# Altium schematic sheet MicroCurrent.SchDoc: ="Title"
size A4; Author: ARNik; SheetNumber: 1; SheetTotal: 1
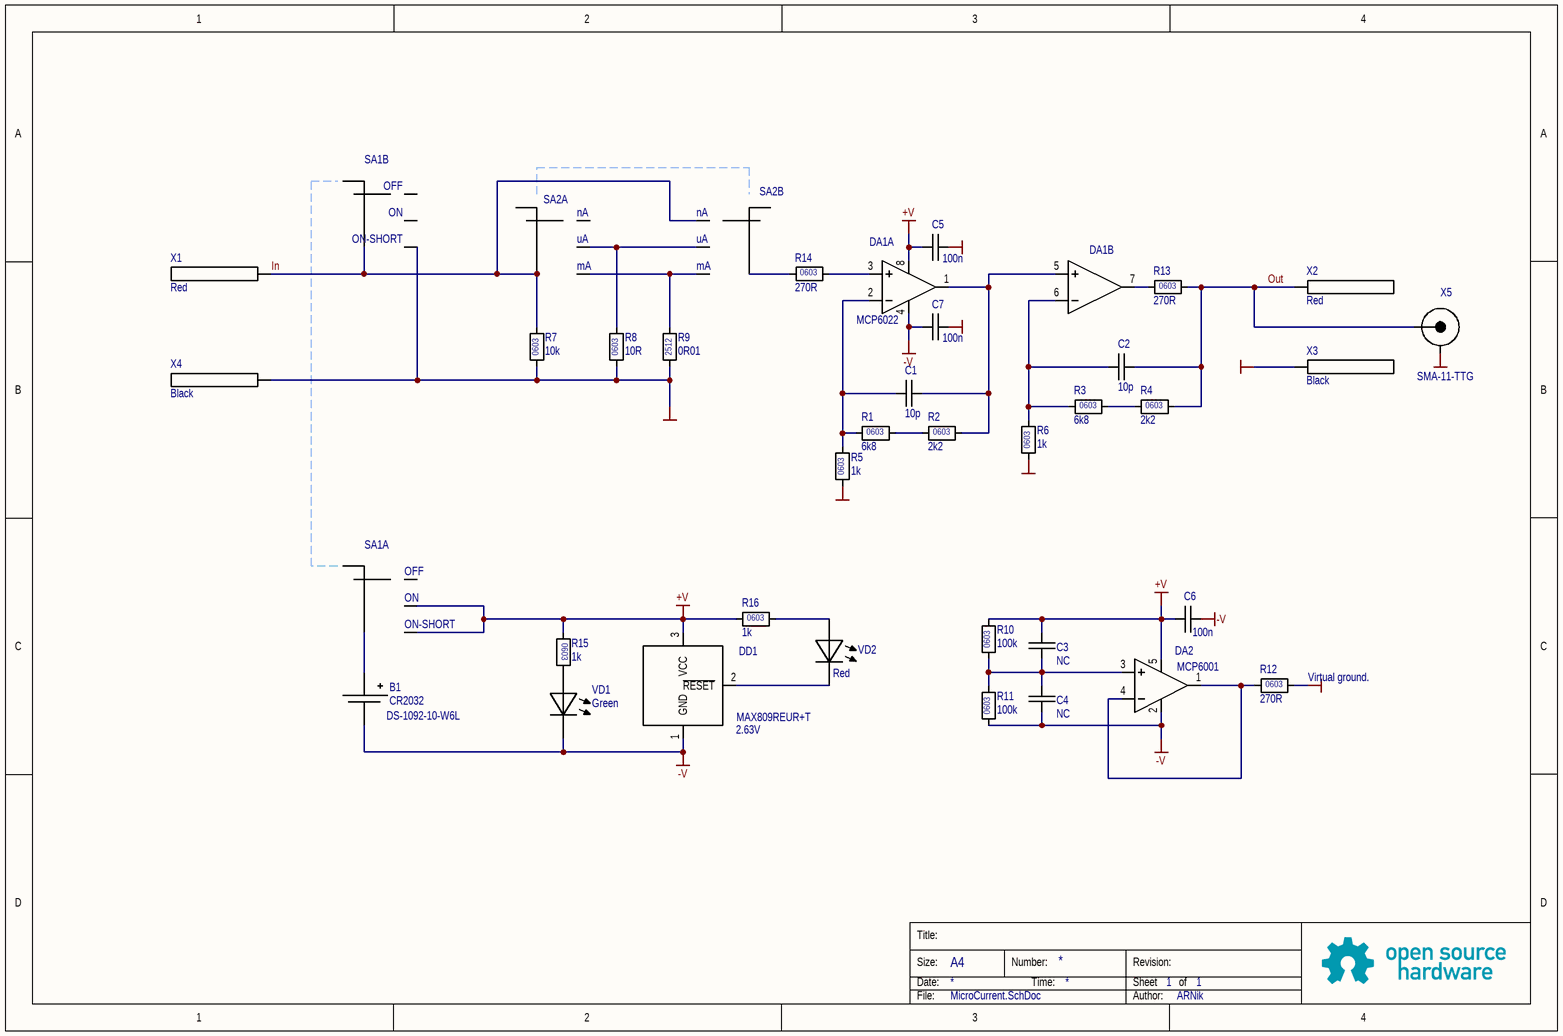
[diagram p0: MicroCurrent.SchDoc]

## Parts
B1  CR2032  Part Number: DS-1092-10-W6L  [DS1092-10-W6L]
C1  10p  [C0603]
C2  10p  [C0603]
C3  NC  [C0603]  (no BOM)
C4  NC  [C0603]  (no BOM)
C5  100n  [C0603]
C6  100n  [C0603]
C7  100n  [C0603]
DA1  MCP6022  [Microchip-SOIC8 SN]  (parts A,B of 2)
DA2  MCP6001  [MICROCHIP-SOT-23-5 OT]
DD1  2.63V  Part Number: MAX809REUR+T  [MAXIM-SOT23-3L]
R1  6k8  [R0603]
R2  2k2  [R0603]
R3  6k8  [R0603]
R4  2k2  [R0603]
R5  1k  [R0603]
R6  1k  [R0603]
R7  10k  [R0603]
R8  10R  [R0603]
R9  0R01  [R2512]
R10  100k  [R0603]
R11  100k  [R0603]
R12  270R  [R0603]
R13  270R  [R0603]
R14  270R  [R0603]
R15  1k  [R0603]
R16  1k  [R0603]
SA1  (no value)  (parts A,B of 2)
SA2  (no value)  (parts A,B of 2)
VD1  Green  [LTST-C191 GREEN]
VD2  Red  [LTST-C193 RED]
X1  Red  [RTC5060185-red]
X2  Red  [RTC5060185-red]
X3  Black  [RTC5060185-black]
X4  Black  [RTC5060185-black]
X5  Connector HF  [SMA-11-TTG]  (value not drawn)  (no BOM)

## Nets
+V: C3.1 C5.1 C6.2 DA1.8(VCC) DA2.5(VCC) DD1.3(VCC) R10.2 R15.1 R16.1 SA1.3.1 SA1.4.1
-V: B1.2 C4.2 C6.1 C7.1 DA1.4(GND) DA2.2(GND) DD1.1(GND) R11.1 VD1.1(C)
GND: C5.2 C7.2 R5.1 R6.1 R7.1 R8.1 R9.1 R12.2 SA1.4.2 X3.1 X4.1 X5.2
In: R7.2 SA1.2.2 SA2.1.2 SA2.2.1 X1.1
Out: C2.2 R4.2 R13.2 X2.1 X5.1
NetB1_1: B1.1 SA1.2.1
NetC1_1: C1.1 DA1.2(1IN-) R1.1 R5.2
NetC1_2: C1.2 DA1.1(1OUT) DA1.5(2IN+) R2.2
NetC2_1: C2.1 DA1.6(2IN-) R3.1 R6.2
NetC3_2: C3.2 C4.1 DA2.3(1IN+) R10.1 R11.2
NetDA1_3: DA1.3(1IN+) R14.2
NetDA1_7: DA1.7(2OUT) R13.1
NetDA2_1: DA2.1(1OUT) DA2.4(1IN-) R12.1
NetDD1_2: DD1.2(~{RESET}) VD2.1(C)
NetR1_2: R1.2 R2.1
NetR3_2: R3.2 R4.1
NetR8_2: R8.2 SA2.3.1 SA2.3.2
NetR9_2: R9.2 SA2.4.1 SA2.4.2
NetR14_1: R14.1 SA2.2.2
NetR15_2: R15.2 VD1.2(A)
NetR16_2: R16.2 VD2.2(A)

Not connected (* = marked no-connect by the designer): SA1 1.1 1.2 3.2; SA2 1.1

## Notes on the sheet
- (near SA1) OFF
- (near SA1) ON
- (near SA1) ON-SHORT
- (near SA2) nA
- (near SA2) uA
- (near SA2) mA
- (near R12) Virtual ground.
- Title:
- Size:
- Date:
- A4
- Number:
- Time:
- Revision:
- Sheet
- of
- File:
- Author:
- (in symbol R0603 1k ±1% E24) 0603
- (in symbol R0603 2k2 ±1% E24) 0603
- (in symbol R0603 6k8 ±1% E24) 0603
- (in symbol R0603 10k ±1% E24) 0603
- (in symbol R0603 10R ±1% E24) 0603
- (in symbol R0603 100k ±1% E24) 0603
- (in symbol R0603 270R ±1% E24) 0603
- (in symbol R2512 1R ±1% E24) 2512

## Library data of the parts
B1 = DS-1092-10-W6L: CR2032 SMD battery holder; Vendor: Connfly; Component Name: DS-1092-10-W6L; HelpURL: https://static.chipdip.ru/lib/011/DOC004011758.pdf; Pins: 2; Value: CR2032
C1 C2 = C0603 10p 100V C0G 125°C ±0.5pF: Commercial Grade Mid Voltage (100 to 630V) ceramic capacitor; Part Number: C1608C0G2A100D080AA; Voltage: 100V; Dielectric: C0G; Tolerance: ±0.5pF; Vendor: TDK; Component Name: C0603 10p 100V C0G 125°C ±0.5pF; HelpURL: https://product.tdk.com/en/search/capacitor/ceramic/mlcc/info?part_no=C1608C0G2A100D080AA; Temperature: -55 to +125°C; Pins: 2; Package: C0603; Value: 10p
C3 C4 = NC 0603 Cap: NC 0603 Capasitor; Component Name: NC 0603 Cap; Pins: 2; Package: C0603; Price: 0; Value: NC
C5-C7 = C0603 100n 100V X7R 125°C ±20%: General  ceramic capacitor; Part Number: GRM188R72A104MA35#; Voltage: 100V; Dielectric: X7R; Tolerance: ±20%; Vendor: Murata; Component Name: C0603 100n 100V X7R 125°C ±20%; HelpURL: https://psearch.en.murata.com/capacitor/result/smd/?pid=GRM188R72A104MA35#; Temperature: 125°C; Pins: 2; Package: C0603; Value: 100n
DA1 = MCP6022xI SN: OpAmp Low offset Low Vcc; Vendor: Microchip; Component Name: MCP6022xI SN; Part Number: MCP6022x; HelpURL: https://static.chipdip.ru/lib/355/DOC004355419.pdf; Pins: 8; Package: SOIC8; Value: MCP6022
DA2 = MCP6001xI OT: Low-Power Op Amp; Vendor: Microchip; Component Name: MCP6001xI OT; Part Number: MCP6001xI OT; HelpURL: https://static.chipdip.ru/lib/174/DOC001174516.pdf; Pins: 5; Package: SOT-23-5; Value: MCP6001
DD1 = MAX809REUR: Microprocessor Reset Circuit; Vendor: Maxim; Component Name: MAX809REUR; HelpURL: https://static.chipdip.ru/lib/235/DOC000235341.pdf; Pins: 3; Package: SOT-23; Value: 2.63V
R1 R3 = R0603 6k8 ±1% E24: Thick Film Chip Resistor - CR Series; Part Number: CR-03FL7---6k8; Alt Part: RTT036801FTH (Ralec); Vendor: Viking; Tolerance: ±1%; Voltage: 75V; Power: 1/10W; Component Name: R0603 6k8 ±1% E24; HelpURL: https://www.viking.com.tw/en/search/index.html?f%5Bname_model%5D=CR-03FL7---6k8&type=product; Pins: 2; Package: R0603; Price: 0.001; Value: 6k8
R2 R4 = R0603 2k2 ±1% E24: Thick Film Chip Resistor - CR Series; Part Number: CR-03FL7---2k2; Alt Part: RTT032201FTH (Ralec); Vendor: Viking; Tolerance: ±1%; Voltage: 75V; Power: 1/10W; Component Name: R0603 2k2 ±1% E24; HelpURL: https://www.viking.com.tw/en/search/index.html?f%5Bname_model%5D=CR-03FL7---2k2&type=product; Pins: 2; Package: R0603; Price: 0.001; Value: 2k2
R5 R6 R15 R16 = R0603 1k ±1% E24: Thick Film Chip Resistor - CR Series; Part Number: CR-03FL7----1k; Alt Part: RTT031001FTH (Ralec); Vendor: Viking; Tolerance: ±1%; Voltage: 75V; Power: 1/10W; Component Name: R0603 1k ±1% E24; HelpURL: https://www.viking.com.tw/en/search/index.html?f%5Bname_model%5D=CR-03FL7----1k&type=product; Pins: 2; Package: R0603; Price: 0.001; Value: 1k
R7 = R0603 10k ±1% E24: Thick Film Chip Resistor - CR Series; Part Number: CR-03FL7---10k; Alt Part: RTT031002FTH (Ralec); Vendor: Viking; Tolerance: ±1%; Voltage: 75V; Power: 1/10W; Component Name: R0603 10k ±1% E24; HelpURL: https://www.viking.com.tw/en/search/index.html?f%5Bname_model%5D=CR-03FL7---10k&type=product; Pins: 2; Package: R0603; Price: 0.001; Value: 10k
R8 = R0603 10R ±1% E24: Thick Film Chip Resistor - CR Series; Part Number: CR-03FL7---10R; Alt Part: RTT03100FTH (Ralec); Vendor: Viking; Tolerance: ±1%; Voltage: 75V; Power: 1/10W; Component Name: R0603 10R ±1% E24; HelpURL: https://www.viking.com.tw/en/search/index.html?f%5Bname_model%5D=CR-03FL7---10R&type=product; Pins: 2; Package: R0603; Price: 0.001; Value: 10R
R9 = R2512 1R ±1% E24: Thick Film Chip Resistor - CR Series; Part Number: CR-12FL4----1R; Alt Part: RTT251R0FTH (Ralec); Vendor: Viking; Tolerance: ±1%; Voltage: 250V; Power: 1W; Component Name: R2512 1R ±1% E24; HelpURL: https://www.viking.com.tw/en/search/index.html?f%5Bname_model%5D=CR-12FL4----1R&type=product; Pins: 2; Package: R2512; Price: 0.001; Value: 0R01
R10 R11 = R0603 100k ±1% E24: Thick Film Chip Resistor - CR Series; Part Number: CR-03FL7--100k; Alt Part: RTT031003FTH (Ralec); Vendor: Viking; Tolerance: ±1%; Voltage: 75V; Power: 1/10W; Component Name: R0603 100k ±1% E24; HelpURL: https://www.viking.com.tw/en/search/index.html?f%5Bname_model%5D=CR-03FL7--100k&type=product; Pins: 2; Package: R0603; Price: 0.001; Value: 100k
R12-R14 = R0603 270R ±1% E24: Thick Film Chip Resistor - CR Series; Part Number: CR-03FL7--270R; Alt Part: RTT032700FTH (Ralec); Vendor: Viking; Tolerance: ±1%; Voltage: 75V; Power: 1/10W; Component Name: R0603 270R ±1% E24; HelpURL: https://www.viking.com.tw/en/search/index.html?f%5Bname_model%5D=CR-03FL7--270R&type=product; Pins: 2; Package: R0603; Price: 0.001; Value: 270R
SA1 SA2 = SS23D07
VD1 = 0603 0h55 5mA GREEN KGKT: TopView Single Color Chip LED; Part Number: LTST-C191KGKT-5A; Vendor: Lite-On; WaveLength: 564.5-573.5 @5mA; Brightness: 4.5-18.0 @ 5mA; Current: 5mA; Component Name: 0603 0h55 5mA GREEN KGKT; HelpURL: http://optoelectronics.liteon.com/en-global/Led/LED-Component/Detail/448?param4=1; Pins: 2; Package: 0603 0h55; Value: Green
VD2 = 0603 0h35 5mA RED KRKT: TopView Single Color Chip LED; Part Number: LTST-C193KRKT-5A; Vendor: Lite-On; WaveLength: 631 @ 5mA; Brightness: 7.1~45 @ 5mA; Current: 5mA; Component Name: 0603 0h35 5mA RED KRKT; HelpURL: http://optoelectronics.liteon.com/en-global/Led/LED-Component/Detail/448?param4=1; Pins: 2; Package: 0603 0h35; Value: Red
X1 X2 = RTC5060185-red: Component Name: RTC5060185-red; Part Number: RTC5060185-red; Pins: 1; Value: Red
X3 X4 = RTC5060185-black: Component Name: RTC5060185-black; Part Number: RTC5060185-black; Pins: 1; Value: Black
X5 = SMA-11-TTG: angle sma connector; Vendor: Nus-Tsan; Component Name: SMA-11-TTG; Part Number: SMA-11-TTG; HelpURL: https://www.chipdip.ru/product/sma-11-tgg; Pins: 2